# EAGLE design usb_qc (EAGLE 9.3.0)
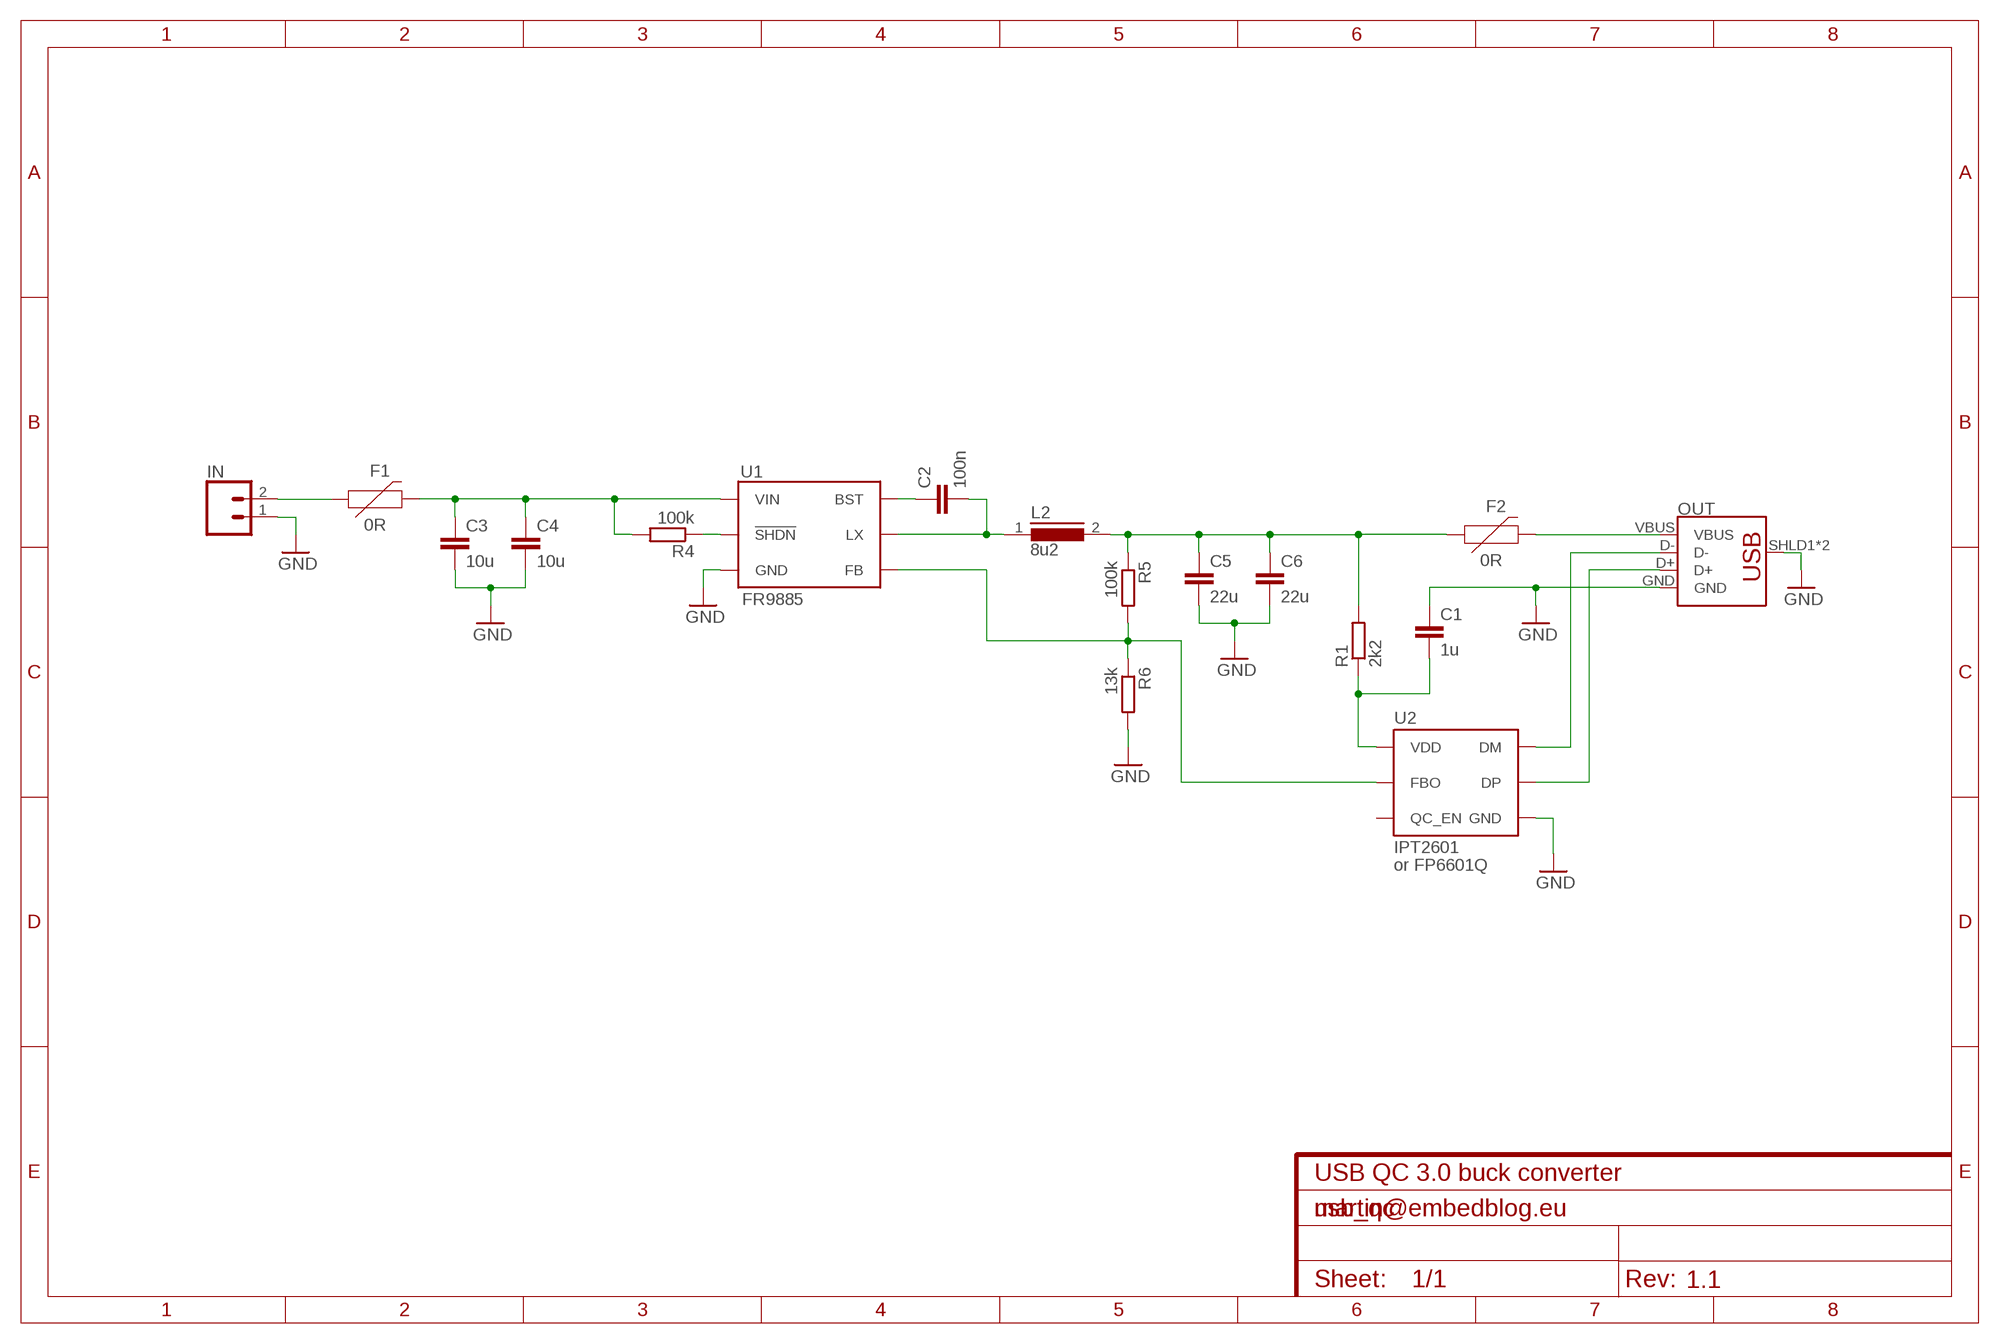
[diagram p0: schematic, sheet 1]
FRAME1 (FRAME-A4L): CNAME: USB QC 3.0 buck converter; CREVISION: 1.1; REV: 1.1

## Parts
C1  1u  C-EUC1206  [C1206]
C2  100n  C-EUC1206  [C1206]
C3  10u  C-EUC1206  [C1206]
C4  10u  C-EUC1206  [C1206]
C5  22u  C-EUC1206  [C1206]
C6  22u  C-EUC1206  [C1206]
F1  0R  PPTC_HALF-AMP  [1206]
F2  0R  PPTC_HALF-AMP  [1206]
IN  5MM_SCREWTERMINAL_LARGE  [SCREWTERMINAL-5MM-2]
L2  8u2  DR73  [DR73]
OUT  USB_A_REVERSED  [USB-A-S-SILK-FEMALE]
R1  2k2  R-EU_R1206  [R1206]
R4  100k  R-EU_R1206  [R1206]
R5  100k  R-EU_R1206  [R1206]
R6  13k  R-EU_R1206  [R1206]
U1  FR9885  [SOT23-6]
U2  IPT2601  [SOT23-6]

## Nets
FB: R5.2 R6.1 U1.3(FB) U2.3(FBO)
GND: C1.1 C3.2 C4.2 C5.2 C6.2 IN.1 OUT.GND OUT.SHLD1(SHIELD) OUT.SHLD2(SHIELD) R6.2 U1.2(GND) U2.2(GND)
LX: C2.2 L2.1 U1.6(LX)
N$1: OUT.D- U2.6(DM)
N$2: OUT.D+ U2.1(DP)
N$3: F1.1 IN.2
N$4: C3.1 C4.1 F1.2 R4.2 U1.5(VIN)
N$5: R4.1 U1.4(!SHDN)
N$8: C5.1 C6.1 F2.1 L2.2 R1.2 R5.1
N$12: C1.2 R1.1 U2.5(VDD)
N$14: C2.1 U1.1(BST)
VBUS: F2.2 OUT.VBUS
Unconnected: U2.4(QC_EN)

## Notes on the sheet
- or FP6601Q
- martin@embedblog.eu

## Library data of the parts
C1-C6 = resistor:C-EU: CAPACITOR, European symbol
F1 F2 = SparkFun-Fuses:PPTC: Resettable Fuse PPTC Resettable Fuse. Really a sort of resistor with a polymeric positive temperature coefficient whose resistance increases dramatically with an increase in temperature. When heated by the power passing through the resistance rises causing the current to be limited, protecting the circuit. This is achieved by the transition of the polymer from a crystalline to an amorphous state where the conductive carbon separates breaking the conductive pathways found in the cool crystalline structure. When a PPTC cools back down it resumes conducting letting the circuit turn back on. SparkFun Products: SparkFun RedBoard - Programmed with Arduino <https://www.sparkfun.com/products/12757> Pro Micro - 5V/16MHz <https://www.sparkfun.com/products/12640> Arduino Pro 328 - 5V/16MHz <https://www.sparkfun.com/products/10915> MP3 Trigger <https://www.sparkfun.com/products/13720>; PROD_ID: RES-08585; VALUE: 6V/0.5A
IN = custom:5MM_SCREWTERMINAL_LARGE
L2 = inductors:DR73: High Power Density, High Efficiency, Shielded Inductors Source: coiltronics_dr_series.pdf; SPICEPREFIX: L
OUT = custom:USB_A_REVERSED
R1 R4-R6 = resistor:R-EU_: RESISTOR, European symbol
U1 = custom:FR9885
U2 = custom:IPT2601

## Board
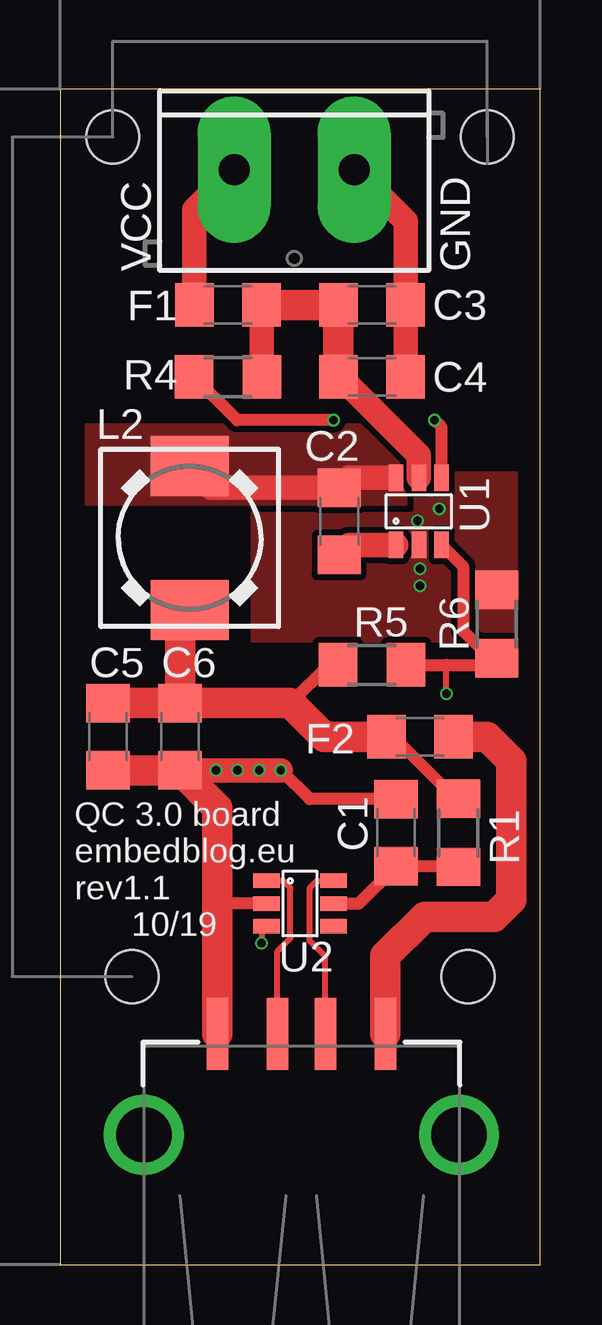
[diagram p1: board, top side]
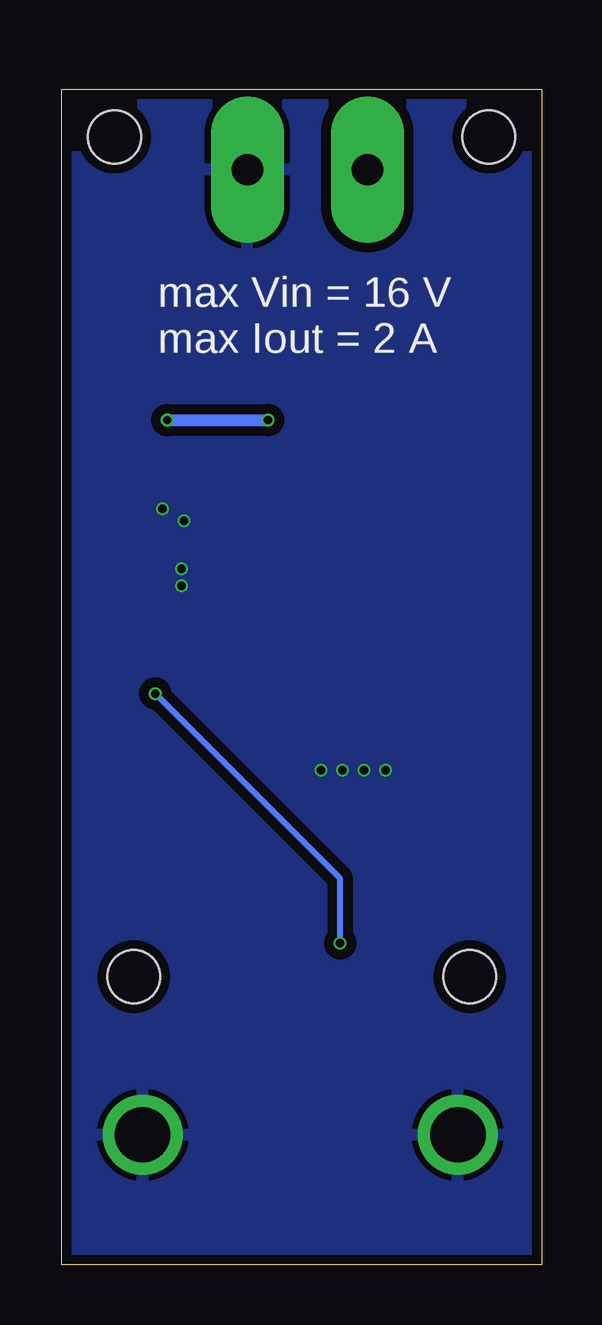
[diagram p2: board, bottom side, seen from below]

Size 20 x 49 mm. Coordinates in mm from the lower left corner, seen from the top.
Outline: 0,0 20,0 20,49 0,49 0,0
Copper layers (1*16): Top 0.035mm / dielectric 1.2mm / Bottom 0.035mm
Design rules "JLCPCB": minimum track width 5mil, minimum drill 0.3mm, track to track 5mil, track to pad 5mil, pad to pad 5mil, via to via 5mil, smd to smd 5mil, copper to edge 0.2mm, drill to drill 6mil, minimum pad ring 3mil, minimum via ring 3mil, stop-mask expansion 4mil, vias tented up to drill 0mil, thermal gap 10mil
Holes 2.2 mm at 3,12 17,12 17.8,47 2.2,47

### Footprints (pad centres in the part's own frame; a part is rotated, then mirrored left to right if it is on the bottom)
C1206 = smd 1.6 x 1.8: 1 -1.4,0; 2 1.4,0
1206 = smd 1.6 x 1.8: 1 -1.4,0; 2 1.4,0
SCREWTERMINAL-5MM-2 = drill 1.3 pad 3.048 long: 1 0,0; 2 5,0
DR73 = smd 2.5 x 3.25: 1 -3,0; 2 3,0
USB-A-S-SILK-FEMALE = smd 3 x 0.9: D+ 7.212,1; D- 7.212,-1; GND 7.212,3.5; VBUS 7.212,-3.5 | drill 2.311: SHLD1 3,-6.566; SHLD2 3,6.566
R1206 = smd 1.6 x 1.803: 1 -1.422,0; 2 1.422,0
SOT23-6 = smd 0.6 x 1.1: 1 0,0; 2 0.95,0; 3 1.9,0; 4 1.9,2.8; 5 0.95,2.8; 6 0,2.8

### Placement (x,y rotation side)
C1  14,18 270 top
C2  11.63,30.98 90 top
C3  13,40 0 top
C4  13,37 0 top
C5  2,22 270 top
C6  5,22 270 top
F1  7,40 0 top
F2  15,22 0 top
IN  12.26,45.64 180 top
L2  5.4,30.29 270 top
OUT  10.06,2.41 90 top
R1  16.6,18 90 top
R4  7,37 0 top
R5  13,25 0 top
R6  18.2,26.7 90 top
U1  14,30 0 top
U2  8.6,16 270 top

### Tracks (layer width: path | path; a pad name or v marks a point on that pad's centre or on a via)
FB  (via drill 0.35)
  Top 0.254: U2.3 8.4,13.9 v8.4,13.4 | v16.1,23.8 16.1,25
  Top 0.508: R5.2 16.1,25 17.92,25 R6.1 17.92,25.28 16.8,26.4 16.8,29.1 U1.3
  Bottom 0.254: v8.4,13.4 8.4,16.1 v16.1,23.8
GND  (via drill 0.35)
  Top 0.508: 14.5,19.4 C1.1 10.4,19.4 v9.2,20.6 | U2.2 6.61,15.05 6.56,15.1
  Top 1.016: C4.2 C3.2 14.4,43.5 IN.1 | 14.02,19.42 C1.1 | C6.2 v6.5,20.6 v7.4,20.6 v8.3,20.6 v9.2,20.6
  Top 1.27: OUT.GND 6.56,15.1 6.56,19.04 C6.2 C5.2
  other vias: 15,29 15,28.3 14.9,31 15.8,31.5
  pour Bottom (isolate 0.406): 0,49 20,49 20,0 0,0
  pour Top (isolate 0.254, rank 2, no thermals): 8,26 19,26 19,33 8,33
LX
  Top 1.016: L2.1 6.31,32.38 C2.2 12.05,32.8 13.78,32.8
  pour Top (isolate 0.254, no thermals): 1.1,35 12.8,35 14.4,33.4 14.4,31.7 1.1,31.7
N$1
  Top 0.254: OUT.D- 11.06,12.84 10.4,13.5 10.4,15.7 10.7,16 U2.6
N$2
  Top 0.254: 9.06,10.86 OUT.D+ 9.06,13.06 9.6,13.6 9.6,15.7 9.3,16 U2.1
N$3
  Top 1.016: F1.1 5.6,43.98 IN.2
N$4
  Top 1.016: F1.2 8.4,37.02 R4.2 | U1.5 14.95,33.75 11.7,37 C4.1
  Top 1.27: C4.1 C3.1 F1.2
N$5  (via drill 0.35)
  Top 0.508: U1.4 15.9,34.9 v15.6,35.2 | v11.4,35.2 7.38,35.2 R4.1
  Bottom 0.508: v15.6,35.2 v11.4,35.2
N$8
  Top 0.508: 9.6,23.4 11.2,25 R5.1 | F2.1 13.9,22 16.48,19.42 R1.2
  Top 1.27: L2.2 5,26.89 C6.1 | C6.1 C5.1 | C6.1 9.6,23.4 11,22 F2.1
N$12
  Top 0.508: 13.98,16.58 C1.2 | R1.1 16.58,16.6 C1.2 | U2.5 12.45,15.05 C1.2
N$14
  Top 1.016: U1.1 12.05,30 C2.1
VBUS
  Top 1.27: OUT.VBUS 13.56,12.86 15.2,14.5 18.1,14.5 18.8,15.2 18.8,21 17.8,22 F2.2

### Text on the board
tPlace: VCC | GND | QC 3.0 board / embedblog.eu / rev1.1 / 10/19
bPlace: max Vin = 16 V / max Iout = 2 A
tNames: U1 | U2